# EAGLE design teensy36-test-harness-4 (EAGLE 9.0.1)
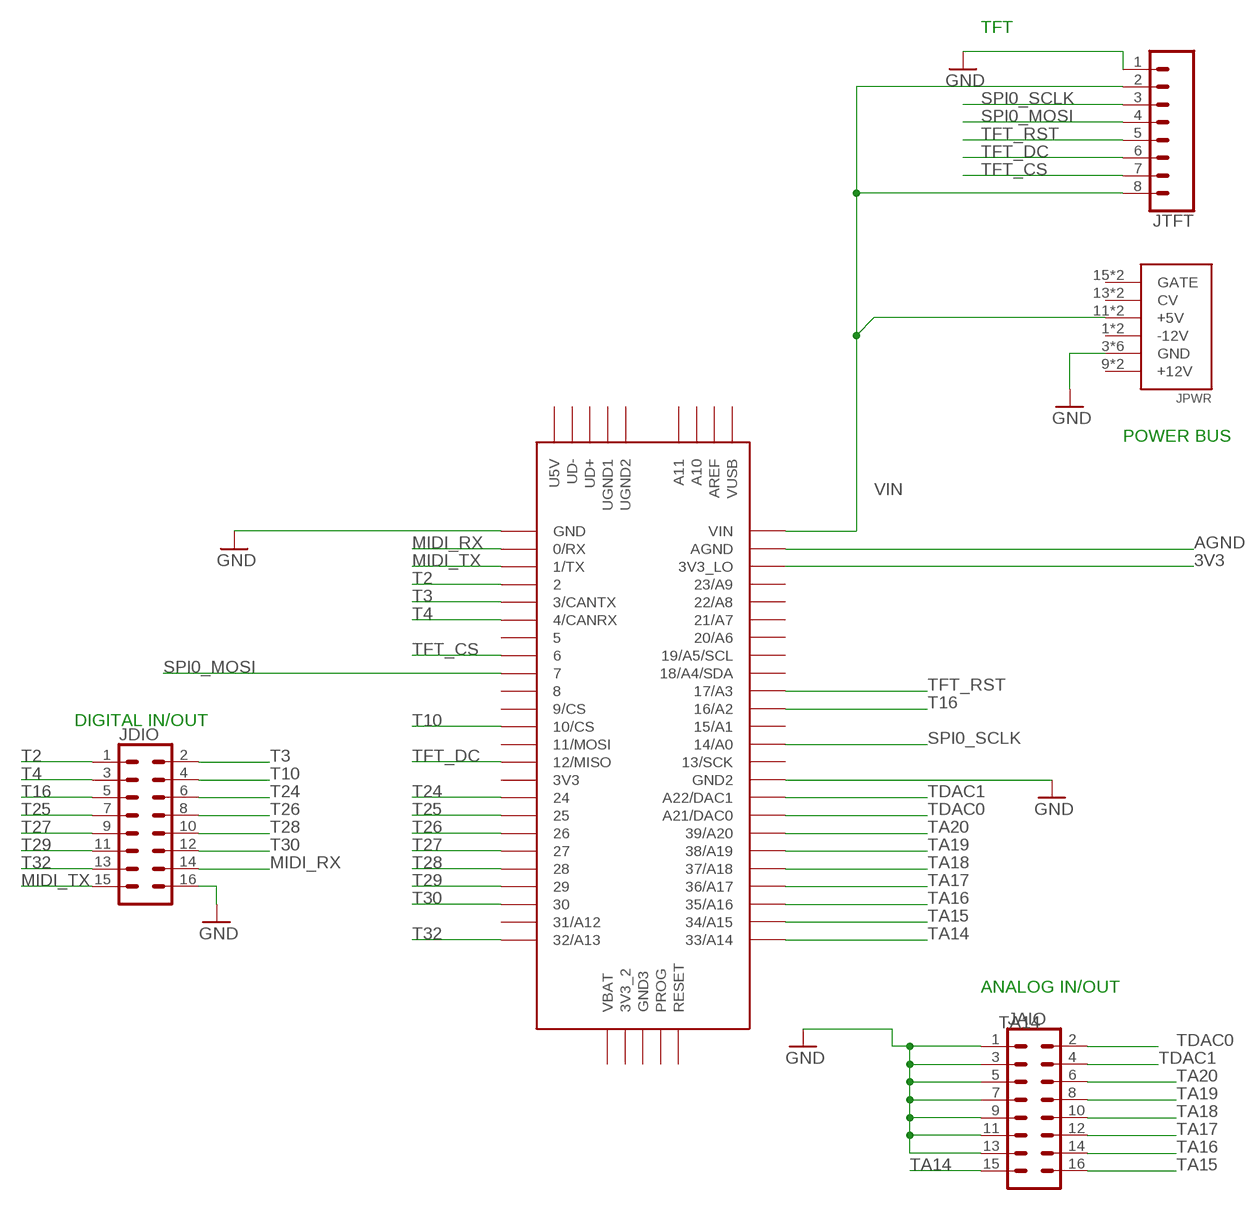
[diagram p0: schematic, sheet 1]

## Parts
JAIO  CONN_08X2  [2X8]
JDIO  CONN_08X2  [2X8]
JPWR  POWER  [POWER_16]
JTFT  CONN_08"  [1X08]
U$3  TEENSY_3.5/3.6  [TEENSY_3.5/3.6]

## Nets
3V3: U$3.3V3_LO
AGND: U$3.AGND
GND: JAIO.1 JAIO.3 JAIO.5 JAIO.7 JAIO.9 JAIO.11 JAIO.13 JDIO.16 JPWR.3(GND) JPWR.4(GND) JPWR.5(GND) JPWR.6(GND) JPWR.7(GND) JPWR.8(GND) JTFT.1 U$3.GND U$3.GND2
MIDI_RX: JDIO.14 U$3.0/RX
MIDI_TX: JDIO.15 U$3.1/TX
SPI0_MOSI: JTFT.4 U$3.7
SPI0_SCLK: JTFT.3 U$3.14/A0
T2: JDIO.1 U$3.2
T3: JDIO.2 U$3.3/CANTX
T4: JDIO.3 U$3.4/CANRX
T10: JDIO.4 U$3.10/CS
T16: JDIO.5 U$3.16/A2
T24: JDIO.6 U$3.24
T25: JDIO.7 U$3.25
T26: JDIO.8 U$3.26
T27: JDIO.9 U$3.27
T28: JDIO.10 U$3.28
T29: JDIO.11 U$3.29
T30: JDIO.12 U$3.30
T32: JDIO.13 U$3.32/A13
TA14: JAIO.15 U$3.33/A14
TA15: JAIO.16 U$3.34/A15
TA16: JAIO.14 U$3.35/A16
TA17: JAIO.12 U$3.36/A17
TA18: JAIO.10 U$3.37/A18
TA19: JAIO.8 U$3.38/A19
TA20: JAIO.6 U$3.39/A20
TDAC0: JAIO.2 U$3.21/DAC0(A21/DAC0)
TDAC1: JAIO.4 U$3.A22/DAC1
TFT_CS: JTFT.7 U$3.6
TFT_DC: JTFT.6 U$3.12/MISO
TFT_RST: JTFT.5 U$3.17/A3
VIN: JPWR.11(+5V) JPWR.12(+5V) JTFT.2 JTFT.8 U$3.VIN
Unconnected: JPWR.1(-12V) JPWR.2(-12V) JPWR.9(+12V) JPWR.10(+12V) JPWR.13(CV) JPWR.14(CV) JPWR.15(GATE) JPWR.16(GATE) U$3.3V3 U$3.3V3_2 U$3.5 U$3.8 U$3.9/CS U$3.11/MOSI U$3.13/SCK U$3.15/A1 U$3.18/A4/SDA U$3.19/A5/SCL U$3.20/A6 U$3.21/A7 U$3.22/A8 U$3.23/A9 U$3.31/A12 U$3.A10 U$3.A11 U$3.AREF U$3.GND3 U$3.PROG U$3.RESET U$3.U5V U$3.UD+ U$3.UD- U$3.UGND1 U$3.UGND2 U$3.VBAT U$3.VUSB

## Notes on the sheet
- TFT
- POWER BUS
- DIGITAL IN/OUT
- ANALOG IN/OUT

## Library data of the parts
JAIO JDIO = SparkFun-Connectors:CONN_08X2: Multi connection point. Often used as Generic Header-pin footprint for 0.1 inch spaced/style header connections You can populate with any combo of single row headers, but if you'd like an exact match, check this: Header - 2x8 (Male, 0.1") <https://www.sparkfun.com/products/13156> (PRT-13156) On any of the 0.1 inch spaced packages, you can populate with these: Break Away Headers - Straight <https://www.sparkfun.com/products/116> (PRT-00116) Break Away Male Headers - Right Angle <https://www.sparkfun.com/products/553> (PRT-00553) Female Headers <https://www.sparkfun.com/products/115> (PRT-00115) Break Away Headers - Machine Pin <https://www.sparkfun.com/products/117> (PRT-00117) Break Away Female Headers - Swiss Machine Pin <https://www.sparkfun.com/products/743> (PRT-00743)
JPWR = eurorack:POWER
JTFT = SparkFun-Connectors:CONN_08: Multi connection point. Often used as Generic Header-pin footprint for 0.1 inch spaced/style header connections On any of the 0.1 inch spaced packages, you can populate with these: Break Away Headers - Straight <https://www.sparkfun.com/products/116> (PRT-00116) Break Away Male Headers - Right Angle <https://www.sparkfun.com/products/553> (PRT-00553) Female Headers <https://www.sparkfun.com/products/115> (PRT-00115) Break Away Headers - Machine Pin <https://www.sparkfun.com/products/117> (PRT-00117) Break Away Female Headers - Swiss Machine Pin <https://www.sparkfun.com/products/743> (PRT-00743) Arduino Stackable Header - 8 Pin <https://www.sparkfun.com/products/9279> (PRT-09279) For SCREWTERMINALS and SPRING TERMINALS visit here: Screw Terimnals on SparkFun.com <https://www.sparkfun.com/search/results?term=Screw+Terminals> (5mm/3.5mm/2.54mm spacing) This device is also useful as a general connection point to wire up your design to another part of your project. Our various solder wires solder well into these plated through hole pads. Hook-Up Wire - Assortment (Stranded, 22 AWG) <https://www.sparkfun.com/products/11375> (PRT-11375) Hook-Up Wire - Assortment (Solid Core, 22 AWG) <https://www.sparkfun.com/products/11367> (PRT-11367) View the entire wire category on our website here <https://www.sparkfun.com/categories/141> Special notes: Molex polarized connector foot print use with SKU : PRT-08231 with associated crimp pins and housings. 1MM SMD Version SKU: PRT-10208 NOTES ON THE VARIANTS LOCK and LOCK_LONGPADS... This footprint was designed to help hold the alignment of a through-hole component (i.e. 6-pin header) while soldering it into place. You may notice that each hole has been shifted either up or down by 0.005 of an inch from it's more standard position (which is a perfectly straight line). This slight alteration caused the pins (the squares in the middle) to touch the edges of the holes. Because they are alternating, it causes a "brace" to hold the component in place. 0.005 has proven to be the perfect amount of "off-center" position when using our standard breakaway headers. Although looks a little odd when you look at the bare footprint, once you have a header in there, the alteration is very hard to notice. Also,if you push a header all the way into place, it is covered up entirely on the bottom side.; PROD_ID: CONN-08438
U$3 = JC_Teensy356:TEENSY_3.5/3.6

## Board
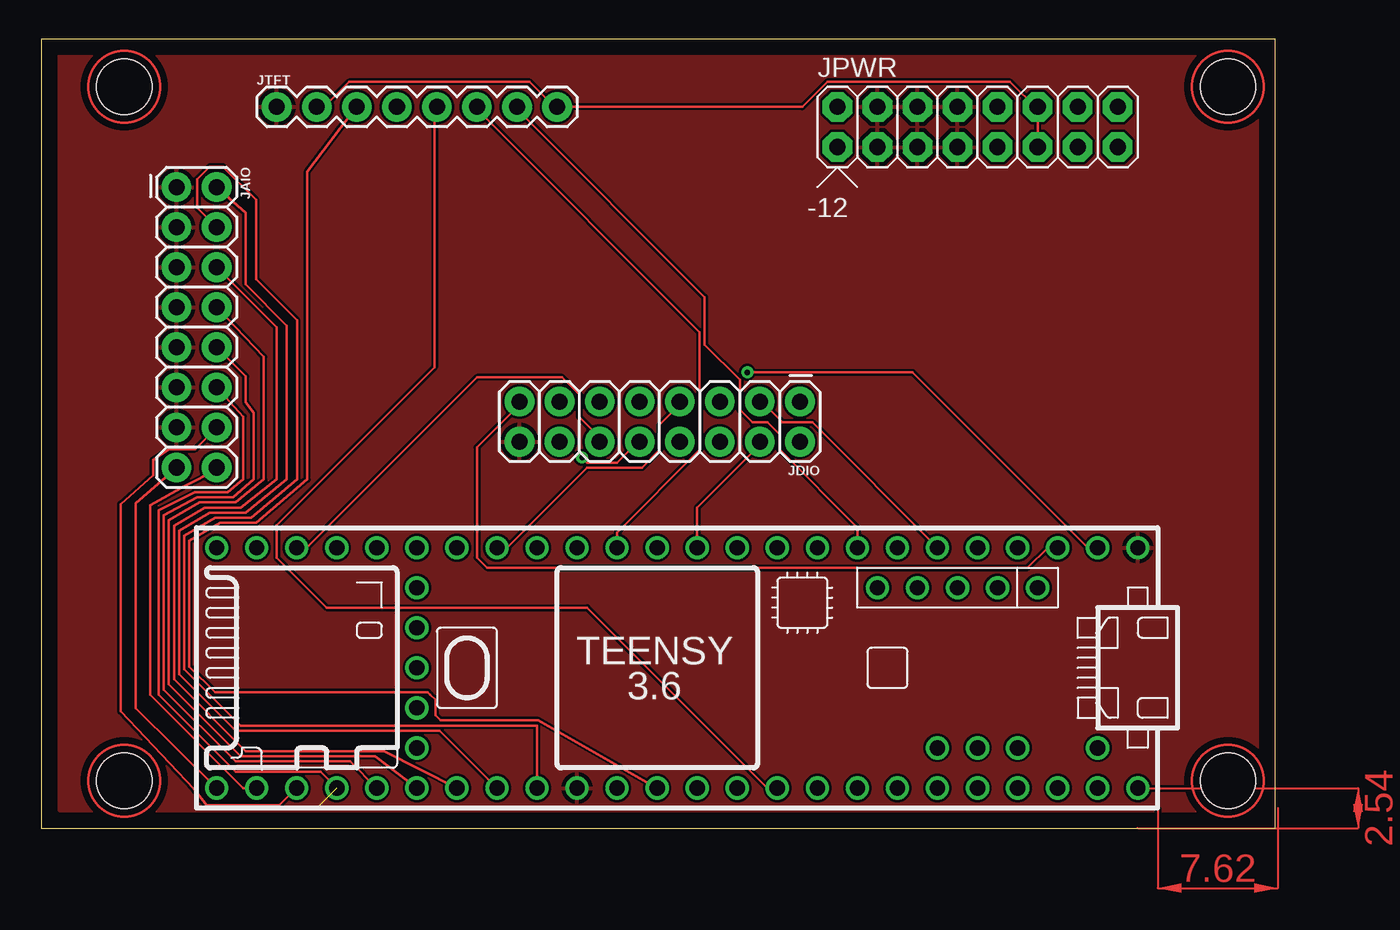
[diagram p1: board, top side]
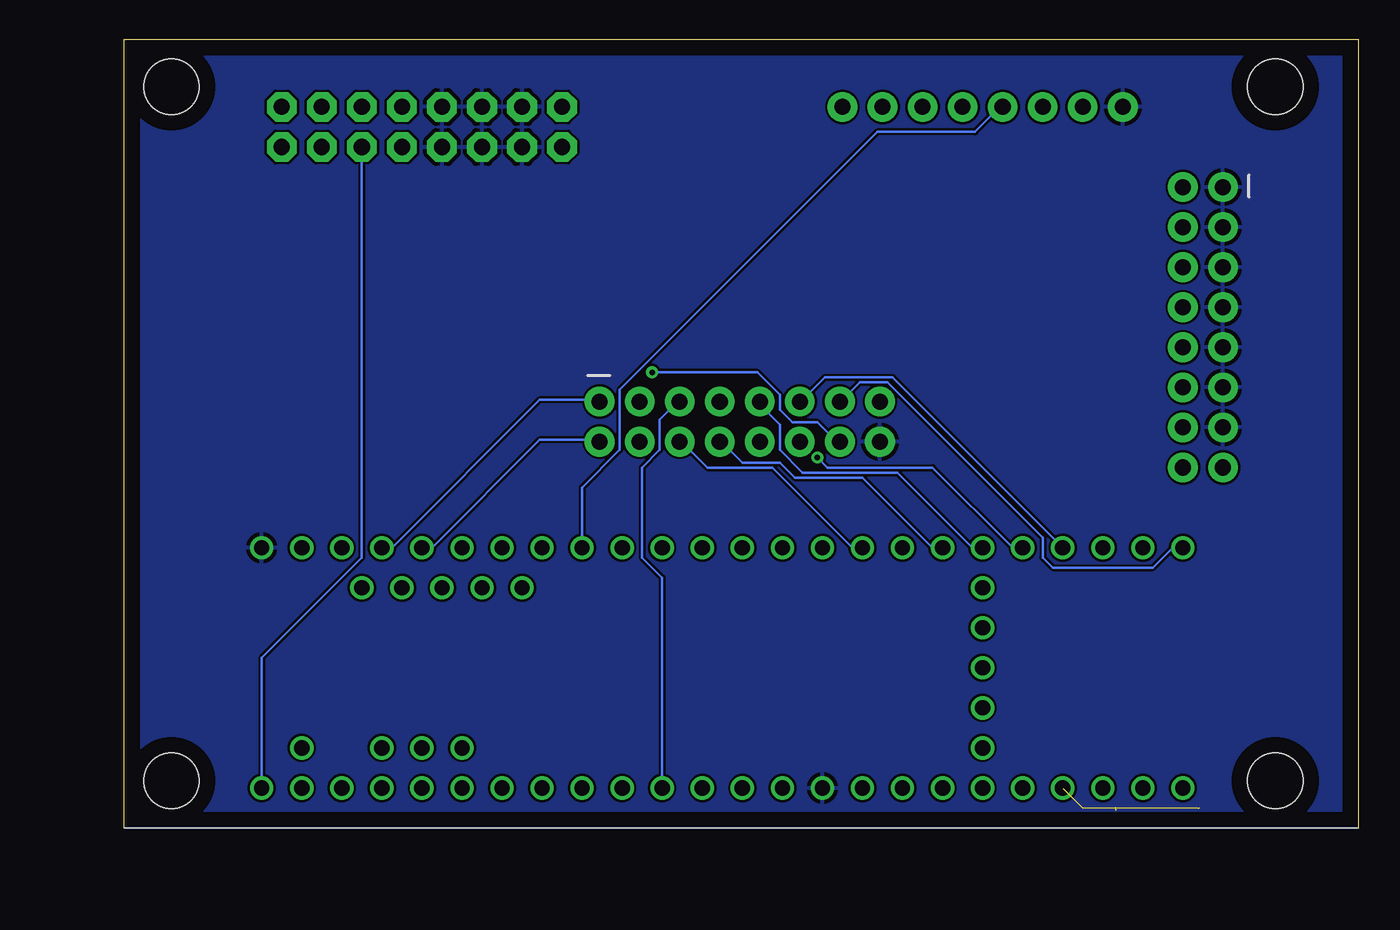
[diagram p2: board, bottom side, seen from below]

Size 78.25 x 50 mm. Coordinates in mm from the lower left corner, seen from the top.
Outline: 0,0 78.25,0 78.25,50 0,50 0,0
Copper layers (1*16): Top 0.035mm / dielectric 1.5mm / Bottom 0.035mm
Design rules "default": minimum track width 6mil, minimum drill 0.35mm, track to track 6mil, track to pad 6mil, pad to pad 6mil, via to via 6mil, smd to smd 6mil, copper to edge 40mil, drill to drill 6mil, minimum pad ring 10mil, minimum via ring 8mil, stop-mask expansion 4mil, vias tented up to drill 0mil, thermal gap 10mil
Holes 3.5 mm at 5.25,3 75.25,3 75.25,47 5.25,47

### Footprints (pad centres in the part's own frame; a part is rotated, then mirrored left to right if it is on the bottom)
2X8 = drill 1.016 pad 1.88: 1 0,0; 2 0,2.54; 3 2.54,0; 4 2.54,2.54; 5 5.08,0; 6 5.08,2.54; 7 7.62,0; 8 7.62,2.54; 9 10.16,0; 10 10.16,2.54; 11 12.7,0; 12 12.7,2.54; 13 15.24,0; 14 15.24,2.54; 15 17.78,0; 16 17.78,2.54
POWER_16 = drill 1.016 pad 1.88 octagon: 1 -6.35,-1.27; 2 -6.35,1.27; 3 -3.81,-1.27; 4 -3.81,1.27; 5 -1.27,-1.27; 6 -1.27,1.27; 7 1.27,-1.27; 8 1.27,1.27; 9 3.81,-1.27; 10 3.81,1.27; 11 6.35,-1.27; 12 6.35,1.27; 13 8.89,-1.27; 14 8.89,1.27; 15 11.43,-1.27; 16 11.43,1.27
1X08 = drill 1.016 pad 1.88: 1 0,0; 2 2.54,0; 3 5.08,0; 4 7.62,0; 5 10.16,0; 6 12.7,0; 7 15.24,0; 8 17.78,0
TEENSY_3.5/3.6 = drill 0.965: 0/RX -25.4,-7.62; 1/TX -22.86,-7.62; 2 -20.32,-7.62; 3/CANTX -17.78,-7.62; 3V3 7.62,-7.62; 3V3_2 17.78,-2.54; 3V3_LO -22.86,7.62; 4/CANRX -15.24,-7.62; 5 -12.7,-7.62; 6 -10.16,-7.62; 7 -7.62,-7.62; 8 -5.08,-7.62; 9/CS -2.54,-7.62; 10/CS 0,-7.62; 11/MOSI 2.54,-7.62; 12/MISO 5.08,-7.62; 13/SCK 5.08,7.62; 14/A0 2.54,7.62; 15/A1 0,7.62; 16/A2 -2.54,7.62; 17/A3 -5.08,7.62; 18/A4/SDA -7.62,7.62; 19/A5/SCL -10.16,7.62; 20/A6 -12.7,7.62; 21/A7 -15.24,7.62; 21/DAC0 12.7,7.62; 22/A8 -17.78,7.62; 23/A9 -20.32,7.62; 24 10.16,-7.62; 25 12.7,-7.62; 26 15.24,-7.62; 27 17.78,-7.62; 28 20.32,-7.62; 29 22.86,-7.62; 30 25.4,-7.62; 31/A12 27.94,-7.62; 32/A13 30.48,-7.62; 33/A14 30.48,7.62; 34/A15 27.94,7.62; 35/A16 25.4,7.62; 36/A17 22.86,7.62; 37/A18 20.32,7.62; 38/A19 17.78,7.62; 39/A20 15.24,7.62; A10 -17.78,5.08; A11 -15.24,5.08; A22/DAC1 10.16,7.62; AGND -25.4,7.62; AREF -20.32,5.08; GND -27.94,-7.62; GND2 7.62,7.62; GND3 17.78,0; PROG 17.78,2.54; RESET 17.78,5.08; U5V -21.59,-5.08; UD+ -16.51,-5.08; UD- -19.05,-5.08; UGND1 -13.97,-5.08; UGND2 -11.43,-5.08; VBAT 17.78,-5.08; VIN -27.94,7.62; VUSB -25.4,5.08

### Placement (x,y rotation side)
JAIO  8.57,40.64 270 top
JDIO  48.1,27.04 180 top
JPWR  56.83,44.45 0 top
JTFT  14.92,45.72 0 top
U$3  41.59,10.16 180 top

### Tracks (layer width: path | path; a pad name or v marks a point on that pad's centre or on a via)
GND
  pour Top: -0.32,49.53 -0.32,2.54 3.49,-1.27 88.58,-1.27 89.85,0 89.85,49.53 84.77,54.61 4.76,54.61
  pour Bottom: -4.13,50.8 0.95,55.88 3.49,55.88 84.77,55.88 91.12,49.53 91.12,-1.27 88.58,-3.81 0.95,-3.81 -4.13,1.27
MIDI_RX  (via drill 0.35)
  Top 0.152: U$3.0/RX 66.36,17.78 55.24,28.89 v44.77,28.89
  Bottom 0.152: v44.77,28.89 38.1,28.89 36.67,27.46 36.67,26.51 35.88,25.72 34.29,25.72 33.02,24.45 JDIO.14
MIDI_TX
  Top 0.152: U$3.1/TX 63.81,17.78 62.55,16.51 28.26,16.51 27.62,17.14 27.62,24.13 30.48,26.99 JDIO.15
SPI0_MOSI
  Bottom 0.152: U$3.7 49.21,21.59 46.83,23.97 46.83,27.78 30.48,44.13 24.29,44.13 22.7,45.72 JTFT.4
SPI0_SCLK
  Top 0.152: U$3.14/A0 31.49,6.83 25.31,6.83 24.99,7.15 24.99,8.13 24.66,8.45 24.5,8.62 11.01,8.62 9.38,10.24 9.38,18.21 11.33,19.34 13.61,19.34 16.86,22.11 16.86,41.62 JTFT.3
T2
  Bottom 0.152: U$3.2 61.28,17.78 51.91,27.15 48.26,27.15 JDIO.1
T3
  Bottom 0.152: U$3.3/CANTX 58.73,17.78 51.91,24.61 48.26,24.61 JDIO.2
T4
  Top 0.152: U$3.4/CANRX 48.89,25.72 46.99,25.72 45.72,26.99 JDIO.3
T10
  Top 0.152: U$3.10/CS 41.59,20.32 45.72,24.45 JDIO.4
T16
  Bottom 0.152: U$3.16/A2 44.13,15.88 45.4,17.14 45.4,22.86 44.29,23.97 44.29,25.88 43.18,26.99 JDIO.5
T24
  Bottom 0.152: U$3.24 32.06,17.78 37.15,22.86 41.27,22.86 43.02,24.61 JDIO.6
T25
  Top 0.152: U$3.25 29.52,17.78 34.6,22.86 38.1,22.86 39.21,23.97 39.21,25.56 40.64,26.99 JDIO.7
T26
  Bottom 0.152: U$3.26 26.98,17.78 31.43,22.23 35.72,22.23 36.67,23.18 39.05,23.18 40.48,24.61 JDIO.8
T27
  Bottom 0.152: U$3.27 24.45,17.78 29.21,22.54 35.24,22.54 36.67,23.97 36.67,25.56 38.1,26.99 JDIO.9
T28  (via drill 0.35)
  Top 0.152: v34.29,23.5 34.6,23.18 36.51,23.18 37.94,24.61 JDIO.10
  Bottom 0.152: U$3.28 21.91,17.78 26.98,22.86 33.65,22.86 v34.29,23.5
T29
  Bottom 0.152: U$3.29 29.52,28.57 33.81,28.57 35.4,26.99 JDIO.11
T30
  Top 0.152: U$3.30 16.82,17.78 27.62,28.57 33.02,28.57 34.13,27.46 34.13,26.04 35.56,24.61 JDIO.12
T32
  Bottom 0.152: U$3.32/A13 11.75,17.78 13.02,16.51 19.36,16.51 20,17.14 20,18.41 29.84,28.26 31.59,28.26 32.86,26.99 JDIO.13
TA14
  Top 0.152: U$3.33/A14 5.97,7.6 5.97,20.58 JAIO.15
TA15
  Top 0.152: JAIO.16 11.11,22.72 9.13,21.71 6.89,20.46 6.89,8.45 12.81,2.54 U$3.34/A15
TA16
  Top 0.152: U$3.35/A16 15.08,1.43 10.49,1.43 9.69,2.47 5.01,7.4 5.01,20.54 7.08,22.38 7.08,23.34 8.09,24.03 9.74,24.03 JAIO.14
TA17  (14 unrouted)
  Top 0.152: U$3.36/A17 17.69,3.58 12.31,3.58 7.43,8.45 7.43,20.16 9.71,21.3 11.82,21.3 12.8,22.11 12.8,26.09 JAIO.12
TA18
  Top 0.152: U$3.37/A18 19.58,4.23 12.31,4.23 7.76,8.78 7.76,19.83 9.87,20.97 12.15,20.97 13.45,22.11 13.45,26.34 12.96,26.98 12.96,28.63 JAIO.10
TA19
  Top 0.152: U$3.38/A19 21.15,4.55 12.63,4.55 8.08,9.1 8.08,12.03 8.08,19.51 10.03,20.64 12.31,20.64 14.1,22.11 14.1,29.87 JAIO.8
TA20
  Top 0.152: U$3.39/A20 21.74,4.88 12.96,4.88 8.41,9.43 8.41,19.18 10.36,20.32 12.63,20.32 14.91,22.11 14.91,31.76 JAIO.6
TDAC0
  Top 0.152: U$3.21/DAC0 25.25,6.18 12.31,6.18 8.73,9.75 8.73,18.86 10.68,20 12.96,20 15.56,22.11 15.56,31.86 12.96,34.46 12.96,39.01 JAIO.2
TDAC1
  Top 0.152: U$3.A22/DAC1 31.43,6.5 12.63,6.5 9.06,10.08 9.06,18.53 11.01,19.67 13.28,19.67 16.21,22.11 16.21,32.19 13.61,34.79 13.61,39.83 11.5,41.94 10.68,41.94 9.87,41.13 9.87,39.34 JAIO.4
TFT_CS
  Top 0.152: U$3.6 51.75,19.05 46.83,23.97 46.83,24.92 46.03,25.72 45.08,25.72 44.29,26.51 44.29,28.42 42.07,30.64 42.07,33.66 30.16,45.56 JTFT.7
TFT_DC
  Top 0.152: U$3.12/MISO 36.51,18.73 41.75,23.97 41.75,31.43 27.62,45.56 JTFT.6
TFT_RST
  Top 0.152: U$3.17/A3 46.03,2.54 34.6,13.97 18.09,13.97 14.92,17.14 14.92,19.21 24.92,29.21 24.92,45.56 JTFT.5
VIN
  Top 0.152: JTFT.2 17.94,45.72 19.52,47.31 30.95,47.31 32.54,45.72 JTFT.8 48.26,45.72 49.84,47.31 61.43,47.31 63.18,45.56 | JPWR.11 63.18,45.56 | 63.18,45.56 JPWR.12
  Bottom 0.152: U$3.VIN 69.53,10.79 63.18,17.14 JPWR.11
(copper drawn outside any net)
  shapes: Bottom area x1, Top area x2, Top circle x4